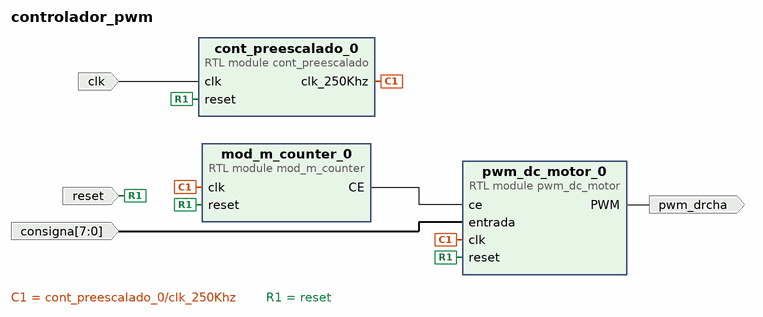
[diagram p0: block diagram of the top level]
# Vivado block design controlador_pwm, xc7z020clg484-1, Vivado 2017.4
create_bd_design controlador_pwm

create_bd_port -dir O pwm_drcha
create_bd_port -dir I -from 7 -to 0 consigna
create_bd_port -dir I clk
create_bd_port -dir I reset

create_bd_cell -type module -reference cont_preescalado cont_preescalado_0
create_bd_cell -type module -reference mod_m_counter mod_m_counter_0
create_bd_cell -type module -reference pwm_dc_motor pwm_dc_motor_0

# ---- connections ----

connect_bd_net [get_bd_pins cont_preescalado_0/clk_250Khz] [get_bd_pins mod_m_counter_0/clk] [get_bd_pins pwm_dc_motor_0/clk]
connect_bd_net [get_bd_pins mod_m_counter_0/CE] [get_bd_pins pwm_dc_motor_0/ce]
connect_bd_net [get_bd_ports reset] [get_bd_pins cont_preescalado_0/reset] [get_bd_pins mod_m_counter_0/reset] [get_bd_pins pwm_dc_motor_0/reset]
connect_bd_net [get_bd_pins pwm_dc_motor_0/PWM] [get_bd_ports pwm_drcha]
connect_bd_net [get_bd_ports consigna] [get_bd_pins pwm_dc_motor_0/entrada]
connect_bd_net [get_bd_ports clk] [get_bd_pins cont_preescalado_0/clk]

validate_bd_design
save_bd_design
